# Altium schematic sheet висур_токовый_Э3.SCHDOC
size 420 x 297 mm; ApprovedBy: Судаков; CheckedBy: Сарайкин; Author: Аршаница; CompanyName: ОКБ Вектор; SheetNumber: 1; SheetTotal: 1; Scale: 1:1; ProcessInspection: Казанов; NormInspection: Коваленко; DocumentType: Схема электрическая принципиальная; PageSetup: Record=PageOptions|CenterHorizontal=True|CenterVertical=True|PrintScale=0.96|XCorrection=1.00|YCorrection=1.00|PrintKind=1|BorderSize=5000000|LeftOffset=0|BottomOffset=0|Orientation=2|PaperLength=1000|PaperWidth=1000|Scale=100|PaperSource=7|PrintQuality=-3|MediaType=1|DitherType=10|PrintScaleMode=1|PaperKind=A3|PaperIndex=8; DocumentName: Sheet1.SCHDOC
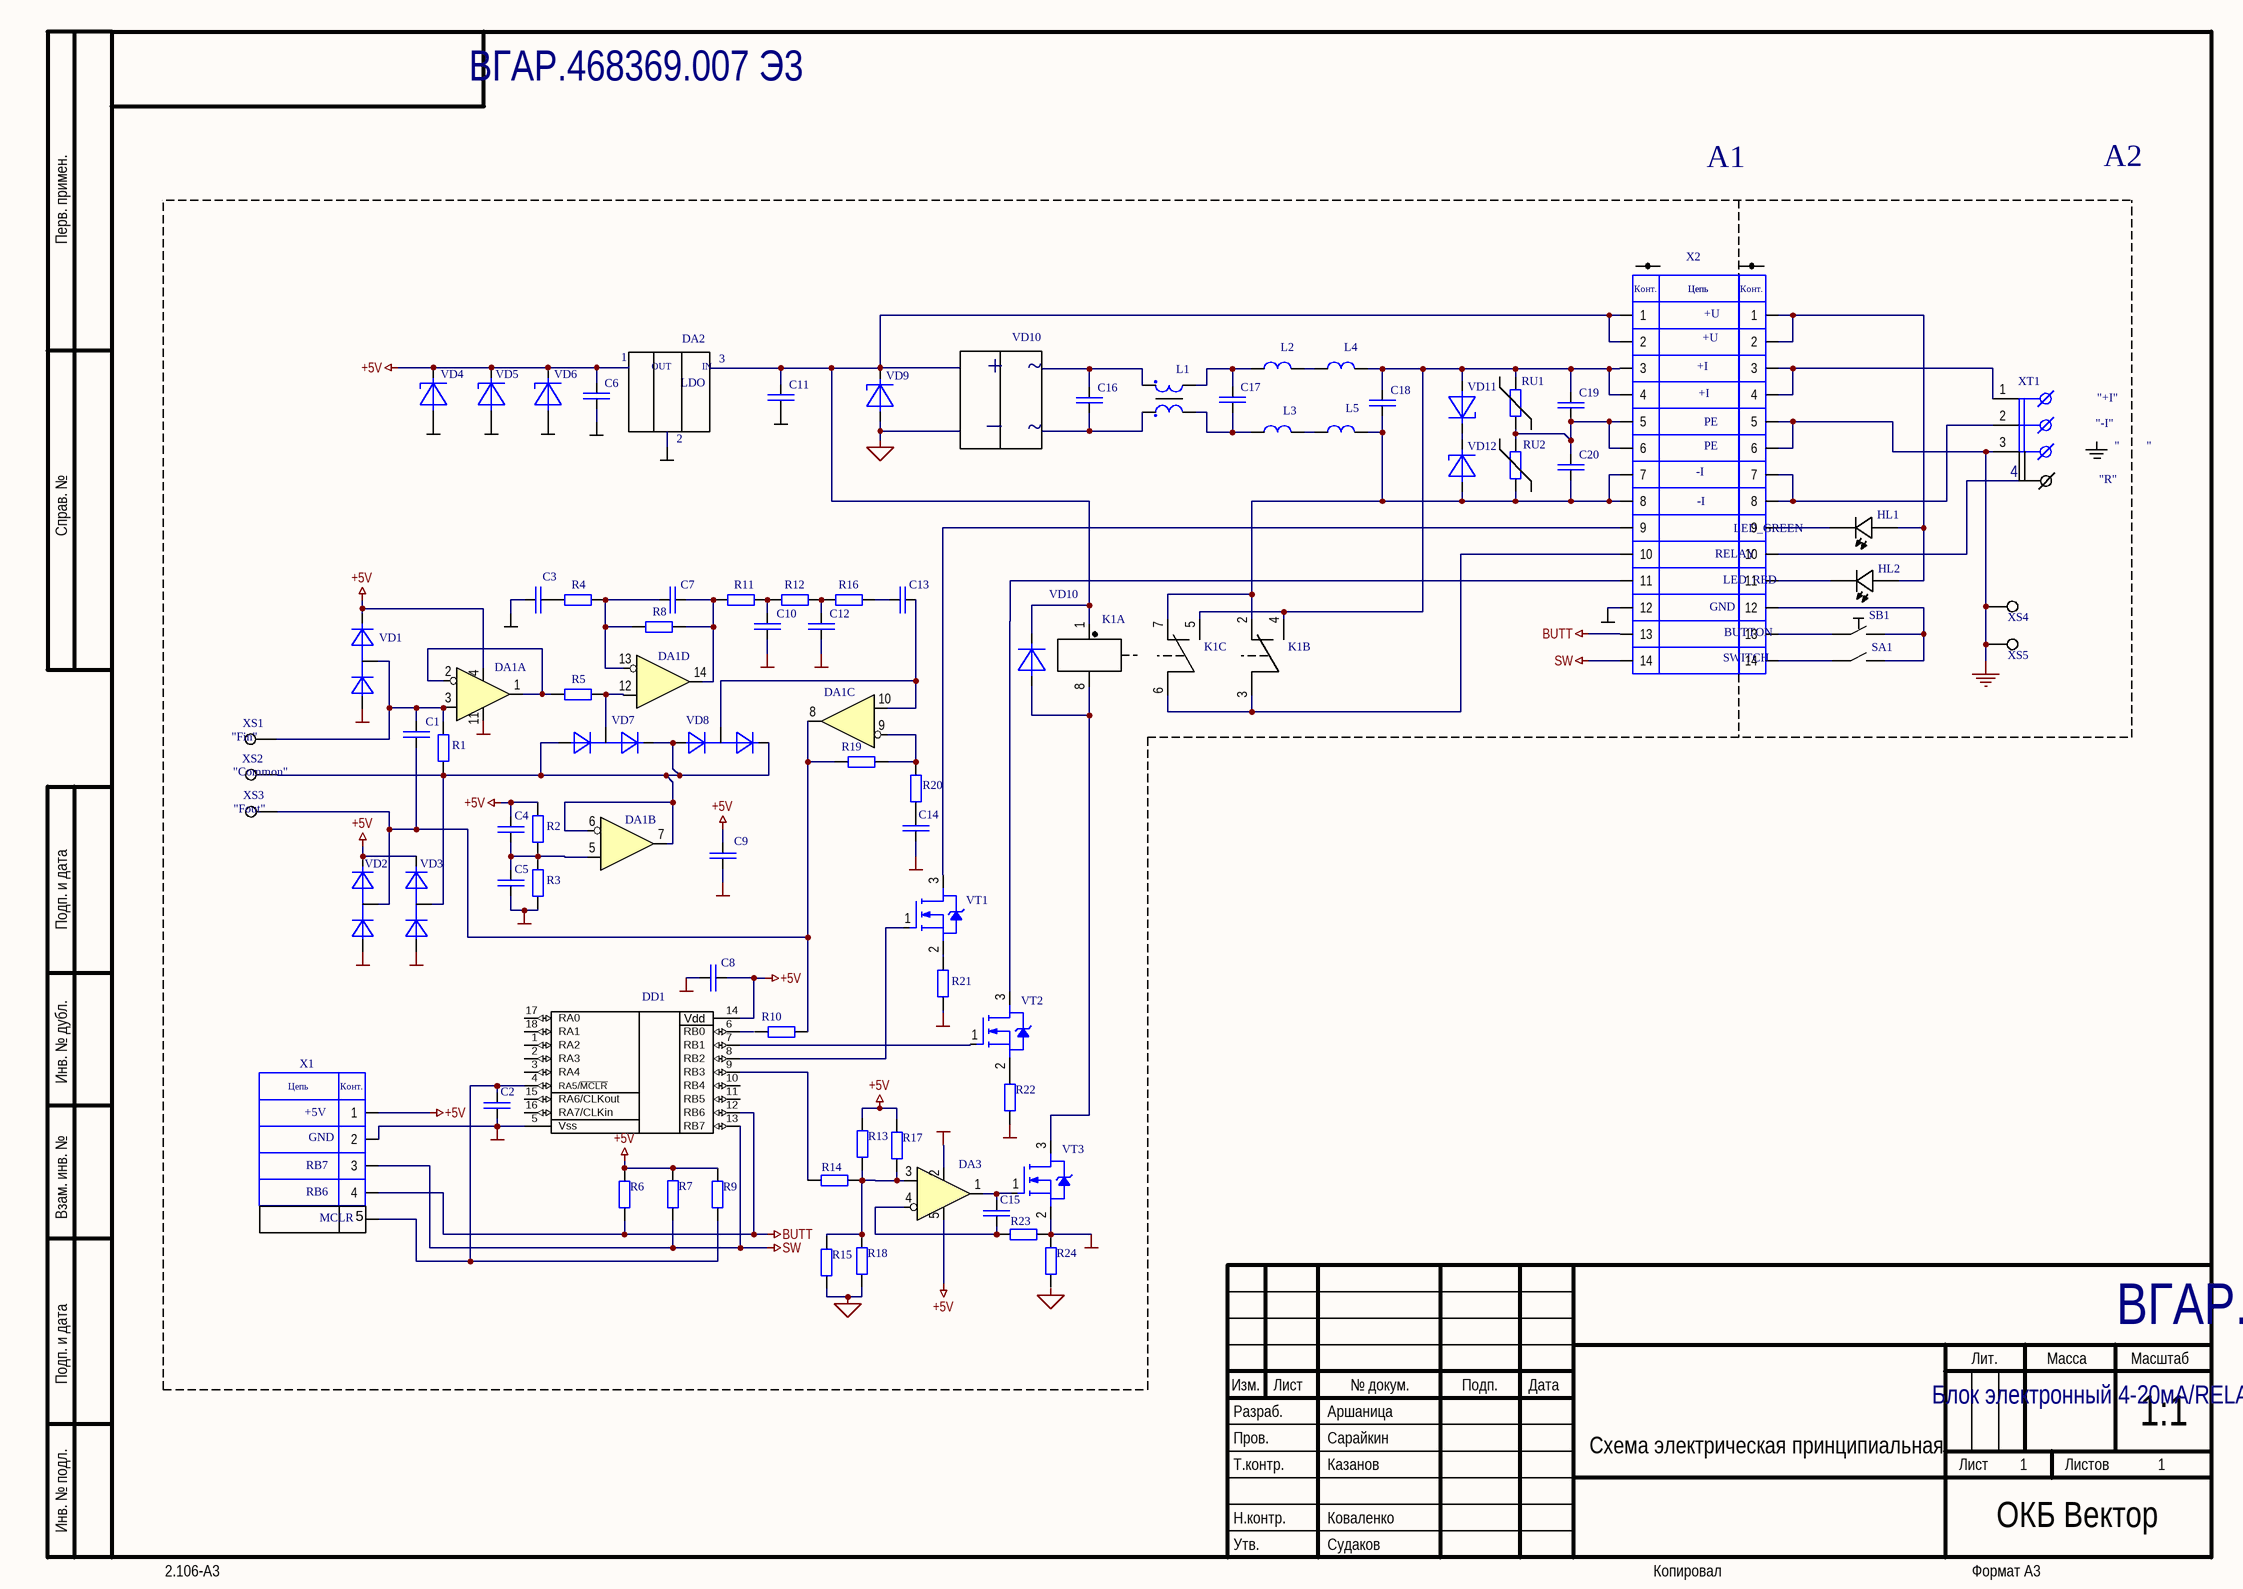
[diagram p0: висур_токовый_Э3.SCHDOC]

## Parts
C1  (no value)  [CAPC_0603(1608)X080L]
C2  (no value)  [CAPC_0603(1608)X080L]
C3  (no value)  [CAPC_0603(1608)X080L]
C4  (no value)  [CAPC_0603(1608)X080L]
C5  (no value)  [CAPC_0603(1608)X080L]
C6  (no value)  [CAPC_0603(1608)X080L]
C7  (no value)  [CAPC_0603(1608)X080L]
C8  (no value)  [CAPC_0603(1608)X080L]
C9  (no value)  [CAPC_0603(1608)X080L]
C10  (no value)  [CAPC_0603(1608)X080L]
C11  (no value)  [CAPC_0603(1608)X080L]
C12  (no value)  [CAPC_0603(1608)X080L]
C13  (no value)  [CAPC_0603(1608)X080L]
C14  (no value)  [CAPC_0603(1608)X080L]
C15  (no value)  [CAPC_0603(1608)X080L]
C16  (no value)  [CAPC_0603(1608)X080L]
C17  (no value)  [CAPC_0603(1608)X080L]
C18  (no value)  [CAPC_0603(1608)X080L]
C19  (no value)  [CAPC_0603(1608)X080L]
C20  (no value)  [CAPC_0603(1608)X080L]
DA1  LMV324  [SO-14]  (value not drawn)  (parts A,B,C,D of 4)
DA3  MCP6001  [SC-70-5]  (value not drawn)
DD1  DD-CPU-PIC16F88SO  [SO18W]  (value not drawn)
HL1  Red  [LED_D5MM]  (value not drawn)
HL2  Red  [LED_D5MM]  (value not drawn)
K1  UB2  [UB2]  (value not drawn)  (parts A,B,C of 3)
L1  L-SF0602  [SF0602]  (value not drawn)
L2  L-1210  [1210]  (value not drawn)
L3  L-1210  [1210]  (value not drawn)
L4  L-0805  [0805]  (value not drawn)
L5  L-0805  [0805]  (value not drawn)
R1  10k  [RESC0603(0201)X02L]  (value not drawn)
R2  10k  [RESC0603(0201)X02L]  (value not drawn)
R3  10k  [RESC0603(0201)X02L]  (value not drawn)
R4  10k  [RESC0603(0201)X02L]  (value not drawn)
R5  10k  [RESC0603(0201)X02L]  (value not drawn)
R6  10k  [RESC0603(0201)X02L]  (value not drawn)
R7  10k  [RESC0603(0201)X02L]  (value not drawn)
R8  10k  [RESC0603(0201)X02L]  (value not drawn)
R9  10k  [RESC0603(0201)X02L]  (value not drawn)
R10  10k  [RESC0603(0201)X02L]  (value not drawn)
R11  10k  [RESC0603(0201)X02L]  (value not drawn)
R12  10k  [RESC0603(0201)X02L]  (value not drawn)
R13  10k  [RESC0603(0201)X02L]  (value not drawn)
R14  10k  [RESC0603(0201)X02L]  (value not drawn)
R15  10k  [RESC0603(0201)X02L]  (value not drawn)
R16  10k  [RESC0603(0201)X02L]  (value not drawn)
R17  10k  [RESC0603(0201)X02L]  (value not drawn)
R18  10k  [RESC0603(0201)X02L]  (value not drawn)
R19  10k  [RESC0603(0201)X02L]  (value not drawn)
R20  10k  [RESC0603(0201)X02L]  (value not drawn)
R21  10k  [RESC0603(0201)X02L]  (value not drawn)
R22  10k  [RESC0603(0201)X02L]  (value not drawn)
R23  10k  [RESC0603(0201)X02L]  (value not drawn)
R24  10k  [RESC0603(0201)X02L]  (value not drawn)
RU1  MOV-14DxxxK  [MOV-14DxxxK]  (value not drawn)
RU2  MOV-14DxxxK  [MOV-14DxxxK]  (value not drawn)
SA1  TL3302BF180QJ  [TL3302BxxxxJ]  (value not drawn)
SB1  TC-0202  [SWT-7]  (value not drawn)
VD1  BAV99W  [SC-70]  (value not drawn)
VD2  BAV99W  [SC-70]  (value not drawn)
VD3  BAV99W  [SC-70]  (value not drawn)
VD4  PTVSxP1UTP  [SOD128]  (value not drawn)
VD5  PTVSxP1UTP  [SOD128]  (value not drawn)
VD6  PTVSxP1UTP  [SOD128]  (value not drawn)
VD7  BAV99W  [SC-70]  (value not drawn)
VD8  BAV99W  [SC-70]  (value not drawn)
VD9  PTVSxP1UTP  [SOD128]  (value not drawn)
VD10  BAV23  [SOT143B]  (value not drawn)  (part A of 2)
VD11  PTVSxP1UTP  [SOD128]  (value not drawn)
VD12  PTVSxP1UTP  [SOD128]  (value not drawn)
VT1  BSS138N  [SOT23]  (value not drawn)
VT2  BSS138N  [SOT23]  (value not drawn)
VT3  BSS138N  [SOT23]  (value not drawn)
X1  PLD2-4  [PLD2-4]  (value not drawn)
X2  PLD2-14R  [PLD2-14R]  (value not drawn)
XS1  Testpoint-TH-1mm  [1mm PAD]  (value not drawn)  (net tie, no BOM)
XS2  Testpoint-TH-1mm  [1mm PAD]  (value not drawn)  (net tie, no BOM)
XS3  Testpoint-TH-1mm  [1mm PAD]  (value not drawn)  (net tie, no BOM)
XS4  Testpoint-TH-1mm  [1mm PAD]  (value not drawn)  (net tie, no BOM)
XS5  Testpoint-TH-1mm  [1mm PAD]  (value not drawn)  (net tie, no BOM)
XS6  Testpoint-TH-1mm  [1mm PAD]  (value not drawn)  (net tie, no BOM)
XS?  PLD2-14R  [PLD2-14R]  (value not drawn)
XT1  MKDSO 2.5/3-L KMGY  [MKDSO 2.5/3-L KMGY]  (value not drawn)

## Nets
+5V: C4.2 C6.2 C8.2 C9.2 DA1.4(+V) DA3.5(+V) DD1.14(Vdd) R2.2 R6.2 R7.2 R9.2 R13.2 R17.2 VD1.2(C) VD2.2(C) VD3.2(C) VD4.1(C) VD5.1(C) VD6.1(C) X1.1
BUTT: DD1.12(RB6) R6.1 X1.4 X2.13
GND: C2.1 C5.1 C6.1 C8.1 C9.1 C10.1 C11.1 C12.1 C14.1 DA1.11(-V) DA3.2(-V) DD1.5(Vss) R3.1 R21.1 R22.1 R24.2 VD1.1(A) VD2.1(A) VD3.1(A) VD4.2(A) VD5.2(A) VD6.2(A) VT3.2(S) X1.2 X2.12
GNDC: R15.1 R18.1 VD9.2(A)
PE: XS4.0 XS5.0 XS?.5 XS?.6 XT1.3
SW: DD1.13(RB7) R7.1 X1.3 X2.14
NetC1_1: C1.1 DA1.8(Vout) R10.2 R19.1 VD2.3(OAC) XS3.0
NetC1_2: C1.2 DA1.3(+InA) R1.2 VD1.3(OAC) XS1.0
NetC2_2: C2.2 DD1.4(RA5/~{MCLR}) R9.1
NetC3_2: C3.2 R4.1
NetC4_1: C4.1 C5.2 DA1.5(+InB) R3.2
NetC7_1: C7.1 DA1.13(-InB) R4.2 R8.1
NetC7_2: C7.2 DA1.14(Vout) R8.2 R11.1
NetC10_2: C10.2 R11.2 R12.1
NetC11_2: C11.2 K1.1 VD9.1(C) VD10.1(C) X2.1 X2.2
NetC12_2: C12.2 R12.2 R16.1
NetC13_1: C13.1 DA1.10(+InB) VD8.3(OAC)
NetC13_2: C13.2 R16.2
NetC14_2: C14.2 R20.1
NetC15_1: C15.1 DA3.4(-InA) R23.2
NetC15_2: C15.2 DA3.1(VoutA) VT3.1(G)
NetC16_1: C16.1 L1.2
NetC16_2: C16.2 L1.1
NetC17_1: C17.1 L1.3 L3.1
NetC17_2: C17.2 L1.4 L2.1
NetC18_1: C18.1 C20.1 K1.2 K1.7 L5.2 RU2.1 VD12.2(A) X2.7 X2.8
NetC18_2: C18.2 C19.2 K1.4 K1.5 L4.2 RU1.2 VD11.2(A) X2.3 X2.4
NetC19_1: C19.1 C20.2 RU1.1 RU2.2 X2.5 X2.6
NetDA1_1: DA1.1(VoutA) DA1.2(-InA) R5.1
NetDA1_6: DA1.6(-InB) DA1.7(Vout) R1.1 VD3.3(OAC) VD7.1(A) VD7.2(C) VD8.1(A) VD8.2(C) XS2.0
NetDA1_9: DA1.9(-InB) R19.2 R20.2
NetDA1_12: DA1.12(+InB) R5.2 VD7.3(OAC)
NetDA3_3: DA3.3(+InA) R13.1 R15.2 R17.1 R18.2
NetDD1_7: DD1.7(RB1) VT2.1(G)
NetDD1_8: DD1.8(RB2) VT1.1(G)
NetDD1_9: DD1.9(RB3) R14.2
NetHL1_1: HL1.1(anode) HL2.1(anode) XS?.1 XS?.2
NetHL1_2: HL1.2(catode) XS?.9
NetHL2_2: HL2.2(catode) XS?.11
NetK1_3: K1.3 K1.6 X2.10
NetK1_8: K1.8 VD10.4(A) VT3.3(D)
NetL2_2: L2.2 L4.1
NetL3_2: L3.2 L5.1
NetR21_2: R21.2 VT1.2(S)
NetR22_2: R22.2 VT2.2(S)
NetSA1_1: SA1.1 XS?.14
NetSA1_2: SA1.2 SB1.2 XS?.12
NetSB1_1: SB1.1 XS?.13
NetVD11_1: VD11.1(C) VD12.1(C)
NetVT1_3: VT1.3(D) X2.9
NetVT2_3: VT2.3(D) X2.11
NetXS6_0: XS6.0 XS?.10
NetXS?_3: XS?.3 XS?.4 XT1.1
NetXS?_7: XS?.7 XS?.8 XT1.2

Not connected (* = marked no-connect by the designer): C3 1; DD1 1(RA2) 2(RA3) 3(RA4) 6(RB0) 10(RB4) 11(RB5) 15(RA6/CLKout) 16(RA7/CLKin) 17(RA0) 18(RA1); R2 1; R10 1; R14 1; R23 1; R24 1

## Notes on the sheet
- ВГАР.468369.007 Э3
- A1
- A2
- +U
- (near C6) 1
- (near C6) OUT
- LDO
- DA2
- IN
- 3
- +
- VD10
- ~
- (near L1) L1
- (near L2) L2
- (near L4) L4
- +I
- 2
- _
- (near L3) L3
- (near L5) L5
- PE
- "-I"
- "+I"
- "         "
- -I
- LED_GREEN
- (near XT1) 4
- (near XS6) "R"
- RELAY
- LED_RED
- GND
- SWITCH
- BUTTON
- (near XS1) "Fin"
- (near XS2) "Common"
- (near XS3) "Fout"
- (near DD1) DD1
- +5V
- RB7
- RB6
- (near X1) MCLR
- (near X1) 5
- Блок электронный 4-20мА/RELAY
- Labels drawn without touching a wire or pin: GNDC
- Перв. примен.
- Справ. №
- Подп. и дата
- Инв. № дубл.
- Взам. инв. №
- Разраб.
- Изм.
- Лист
- № докум.
- Подп.
- Дата
- Лит.
- Масса
- Масштаб
- Пров.
- Т.контр.
- Листов
- Инв. № подл.
- Утв.
- Н.контр.
- 2.106-A3
- Копировал
- Формат А3
- (in symbol PLD2-4) Цепь; Конт.
- (in symbol PLD2-14R) Конт.; Цепь

## Library data of the parts
C1-C20 = Capacitor Ceramic: Конденсатор; Manufacturer: Murata; PartNumber: 0603 - 0,1 мкФ ± 10 % - 50 В - X7R; ReplacementPart1Manufacturer: TDK; ReplacementPart2Manufacturer: Taiyo Yuden; TC Code: X7R; Tolerance: ±10%; Case: 0603; ComponentLink1Description: Global Data; ComponentLink1URL: http://www.murata.com/products/capacitor/tech_data/index.html; ComponentLink2Description: Part Data Sheet; ComponentLink2URL: *; ComponentLink3Description: Replacement Data Sheet; ComponentLink3URL: *; ComponentLink4Description: Replacement 2 Data Sheet; ComponentLink4URL: *; ReplacementPart1PartNumber: *; ReplacementPart2PartNumber: *; Ripple Current Rating: *; Temperature Range: -55 to +125°C
DA1 = LMV324: Микросхема; Manufacturer: Texas Instruments; ComponentLink1Description: Data Sheet; ComponentLink2Description: Replacement 1 Data Sheet; ComponentLink2URL: *; ComponentLink3Description: Replacement 2 Data Sheet; ComponentLink3URL: *; ReplacementPart1Manufacturer: *; ReplacementPart1PartNumber: *; ReplacementPart1TopMarking: *; ReplacementPart2Manufacturer: *; ReplacementPart2PartNumber: *; ReplacementPart2TopMarking: *; TopMarking: *
DA3 = MCP6001: Ethernet Controller  with SPI Interface
HL1 HL2 = 5mm_round: Светодиод
L1 = L-SF0602: Value: 47uG
L2 L3 = L-1210: Value: 100uG
L4 L5 = L-0805: Value: 1k/100MHz
R1-R24 = Resistor: Резистор; Manufacturer: Bourns; PartNumber: {Case Size} - {Value} Ом ± 1 %; Max Rated DC Voltage: Vmax; Power: Вт; Rated DC Voltage: V; Rated T: -55 °C to +125 °C; Tolerance: ±1 %; ComponentLink1Description: Data Sheet; ComponentLink1URL: *; ComponentLink2Description: Specific Res Only; ComponentLink2URL: *; ComponentLink3Description: Replacement Data Sheet; ComponentLink3URL: *; ComponentLink4Description: Replacement 2 Data Sheet; ComponentLink4URL: *; ReplacementPart1Manufacturer: *; ReplacementPart1PartNumber: *; ReplacementPart2Manufacturer: *; ReplacementPart2PartNumber: *; Temperature Range: -55 to +125°C; Value: 10k
SA1 = TL3302BF180QJ: Кнопка тактовая; Manufacturer: E-Switch; ReplacementPart1Manufacturer: APEM; ReplacementPart1PartNumber: ADTSM3; ReplacementPart2Manufacturer: Switronic; ReplacementPart2PartNumber: IT-1101NHA; ComponentLink1Description: Data Sheet; ComponentLink1URL: http://www.e-switch.com/Portals/0/Series_Pdf/TL3302.pdf; ComponentLink2Description: Replacement 1 DataSheet; ComponentLink2URL: http://www.apem.com/pdf/ADTS3.pdf; PartNumber: TL3302BF180QJ; ComponentLink3Description: Replacement 2 Data Sheet; ComponentLink3URL: http://www.switronic.com.tw/CatalogPage/4_A5.htm
SB1 = SWT-7: Кнопка тактовая; Manufacturer: Wealth Metal Factory Ltd; ReplacementPart1Manufacturer: SWITRONIC; ReplacementPart1PartNumber: 0743HIM-130G; ComponentLink1Description: Data Sheet; ComponentLink1URL: http://www.wealthmetal.com/en/pro_show.asp?product_id=241; ComponentLink2Description: Replacement 1 DataSheet; ComponentLink2URL: http://www.switronic.com/; PartNumber: TC-0202; ComponentLink3Description: Replacement 2 Data Sheet
VD1-VD3 VD7 VD8 = BAV99W: Сборка диодная; Manufacturer: NXP; PartNumber: BAT54SW; ReplacementPart1Manufacturer: ON Semiconductor; ReplacementPart1PartNumber: BAT54SWT1G; ReplacementPart1TopMarking: B8*; ReplacementPart2Manufacturer: Infineon; ReplacementPart2TopMarking: TS; ReplacementPart2PartNumber: BAT54-04W; TopMarking: 44; Package: SC-70; ComponentLink1Description: DataSheet; ComponentLink1URL: http://www.nxp.com/documents/data_sheet/BAT54W.pdf; Power/Voltage: *; Type: *; ComponentLink2URL: http://www.onsemi.com/pub_link/Collateral/BAT54SWT1-D.PDF; ComponentLink3Description: Replacement2DataSheet; ComponentLink3URL: http://www.infineon.com/dgdl/bat54series.pdf?folderId=db3a30431400ef68011425f1ca2505e3&fileId=db3a304314dca3890115190b74210ea6; ComponentLink2Description: Replacement1DataSheet
VD4-VD6 VD9 VD11 VD12 = PTVSxP1UTP: TVS-диод; Manufacturer: NXP; Package: SOD-882D; ComponentLink1Description: DataSheet; ComponentLink1URL: *; Power/Voltage: *; Type: *; ComponentLink2URL: *; ComponentLink3Description: Replacement2DataSheet; ComponentLink3URL: *; ComponentLink2Description: Replacement1DataSheet; ReplacementPart2TopMarking: *; ReplacementPart1Manufacturer: *; ReplacementPart1PartNumber: *; ReplacementPart1TopMarking: *; ReplacementPart2Manufacturer: *
VD10 = BAV23: Сборка диодная; ReplacementPart1Manufacturer: Infineon; ReplacementPart1PartNumber: BAW101; ReplacementPart1TopMarking: JPs; Manufacturer: NXP; TopMarking: *L3; Type: *; Power/Voltage: *; PartNumber: BAV23; Package: SOT143B; ComponentLink1Description: DataSheet; ComponentLink1URL: http://www.nxp.com/documents/data_sheet/BAV23_SER.pdf; ComponentLink2URL: http://www.infineon.com/dgdl/baw101series.pdf?folderId=db3a30431400ef6801141b5844e103ea&fileId=db3a30431400ef6801141c22fea80436; ComponentLink3Description: *; ComponentLink3URL: *; ComponentLink2Description: Replacement1DataSheet; ReplacementPart2TopMarking: *; ReplacementPart2Manufacturer: *; ReplacementPart2PartNumber: *
VT1-VT3 = BSS138N: Транзистор; Manufacturer: Fairchild Semiconductor; PartNumber: BSS138; ReplacementPart1Manufacturer: ON Semiconductor; ReplacementPart1PartNumber: BSS138LT1; ReplacementPart1TopMarking: J1; ReplacementPart2Manufacturer: NXP; ReplacementPart2PartNumber: 2N7002; ReplacementPart2TopMarking: 702; TopMarking: SS; ComponentLink1Description: Data Sheet; ComponentLink1URL: http://www.fairchildsemi.com/ds/BS/BSS138.pdf; ComponentLink2Description: Replacement 1 Data Sheet; ComponentLink2URL: http://www.onsemi.com/pub_link/Collateral/BSS138LT1-D.PDF; ComponentLink3Description: Replacement 2 Data Sheet; ComponentLink3URL: http://www.nxp.com/documents/data_sheet/2N7002.pdf
X1 = PLD2-4: Вилка на плату; Manufacturer: Бурый Медведь; ReplacementPart1Manufacturer: Samtec; ReplacementPart1PartNumber: TMM-102-03-L-D; ComponentLink1Description: Data Sheet; ComponentLink1URL: http://www.brownbear.ru/goods4/1020.html; PartNumber: PLD2-4; ComponentLink2Description: Replacement 1Data Sheet; ComponentLink2URL: http://www.samtec.com/documents/webfiles/pdf/TMM_TH.PDF
X2 XS? = PLD2-14R: розетка на плату; Manufacturer: Бурый Медведь; ReplacementPart1Manufacturer: Samtec; ReplacementPart1PartNumber: TMM-102-03-L-D; ComponentLink1Description: Data Sheet; ComponentLink1URL: http://www.brownbear.ru/goods4/1020.html; ComponentLink2Description: Replacement 1Data Sheet; ComponentLink2URL: http://www.samtec.com/documents/webfiles/pdf/TMM_TH.PDF
XS1-XS6 = Testpoint-TH-1mm: Dummy Pad
DD1 = DD-CPU-PIC16F88SO: Value: *